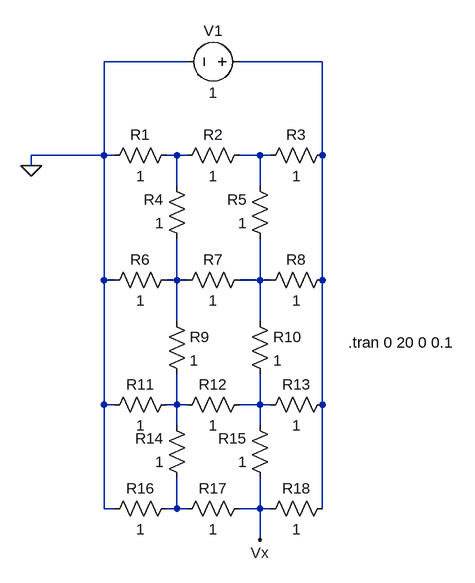
[diagram p0: schematic Q5b.asc]
Q5b.asc, the LTspice schematic file:
Version 4
SHEET 1 880 748
WIRE 144 -64 16 -64
WIRE 352 -64 224 -64
WIRE 16 80 16 -64
WIRE 16 80 -96 80
WIRE 32 80 16 80
WIRE 128 80 112 80
WIRE 144 80 128 80
WIRE 256 80 224 80
WIRE 272 80 256 80
WIRE 352 80 352 -64
WIRE -96 96 -96 80
WIRE 128 128 128 80
WIRE 256 128 256 80
WIRE 16 272 16 80
WIRE 32 272 16 272
WIRE 128 272 128 208
WIRE 128 272 112 272
WIRE 144 272 128 272
WIRE 256 272 256 208
WIRE 256 272 224 272
WIRE 272 272 256 272
WIRE 352 272 352 80
WIRE 128 336 128 272
WIRE 256 336 256 272
WIRE 16 464 16 272
WIRE 32 464 16 464
WIRE 128 464 128 416
WIRE 128 464 112 464
WIRE 144 464 128 464
WIRE 256 464 256 416
WIRE 256 464 224 464
WIRE 272 464 256 464
WIRE 352 464 352 272
WIRE 128 496 128 464
WIRE 256 496 256 464
WIRE 16 624 16 464
WIRE 32 624 16 624
WIRE 128 624 128 576
WIRE 128 624 112 624
WIRE 144 624 128 624
WIRE 256 624 256 576
WIRE 256 624 224 624
WIRE 272 624 256 624
WIRE 352 624 352 464
WIRE 256 672 256 624
FLAG -96 96 0
FLAG 256 672 Vx
SYMBOL res 128 64 R90
WINDOW 0 0 56 VBottom 2
WINDOW 3 32 56 VTop 2
SYMATTR InstName R1
SYMATTR Value 1
SYMBOL res 240 64 R90
WINDOW 0 0 56 VBottom 2
WINDOW 3 32 56 VTop 2
SYMATTR InstName R2
SYMATTR Value 1
SYMBOL res 368 64 R90
WINDOW 0 0 56 VBottom 2
WINDOW 3 32 56 VTop 2
SYMATTR InstName R3
SYMATTR Value 1
SYMBOL res 144 224 R180
WINDOW 0 36 76 Left 2
WINDOW 3 36 40 Left 2
SYMATTR InstName R4
SYMATTR Value 1
SYMBOL res 272 224 R180
WINDOW 0 36 76 Left 2
WINDOW 3 36 40 Left 2
SYMATTR InstName R5
SYMATTR Value 1
SYMBOL res 16 288 R270
WINDOW 0 32 56 VTop 2
WINDOW 3 0 56 VBottom 2
SYMATTR InstName R6
SYMATTR Value 1
SYMBOL res 128 288 R270
WINDOW 0 32 56 VTop 2
WINDOW 3 0 56 VBottom 2
SYMATTR InstName R7
SYMATTR Value 1
SYMBOL res 256 288 R270
WINDOW 0 32 56 VTop 2
WINDOW 3 0 56 VBottom 2
SYMATTR InstName R8
SYMATTR Value 1
SYMBOL res 112 320 R0
SYMATTR InstName R9
SYMATTR Value 1
SYMBOL res 240 320 R0
SYMATTR InstName R10
SYMATTR Value 1
SYMBOL res 128 448 R90
WINDOW 0 0 56 VBottom 2
WINDOW 3 32 56 VTop 2
SYMATTR InstName R11
SYMATTR Value 1
SYMBOL res 240 448 R90
WINDOW 0 0 56 VBottom 2
WINDOW 3 32 56 VTop 2
SYMATTR InstName R12
SYMATTR Value 1
SYMBOL res 368 448 R90
WINDOW 0 0 56 VBottom 2
WINDOW 3 32 56 VTop 2
SYMATTR InstName R13
SYMATTR Value 1
SYMBOL res 144 592 R180
WINDOW 0 36 76 Left 2
WINDOW 3 36 40 Left 2
SYMATTR InstName R14
SYMATTR Value 1
SYMBOL res 272 592 R180
WINDOW 0 36 76 Left 2
WINDOW 3 36 40 Left 2
SYMATTR InstName R15
SYMATTR Value 1
SYMBOL res 128 608 R90
WINDOW 0 0 56 VBottom 2
WINDOW 3 32 56 VTop 2
SYMATTR InstName R16
SYMATTR Value 1
SYMBOL res 240 608 R90
WINDOW 0 0 56 VBottom 2
WINDOW 3 32 56 VTop 2
SYMATTR InstName R17
SYMATTR Value 1
SYMBOL res 368 608 R90
WINDOW 0 0 56 VBottom 2
WINDOW 3 32 56 VTop 2
SYMATTR InstName R18
SYMATTR Value 1
SYMBOL voltage 240 -64 R90
WINDOW 0 -32 56 VBottom 2
WINDOW 3 32 56 VTop 2
WINDOW 123 0 0 Left 0
WINDOW 39 0 0 Left 0
SYMATTR InstName V1
SYMATTR Value 1
TEXT 392 368 Left 2 !.tran 0 20 0 0.1

The netlist it stands for:
* Q5b.asc
R1 N002 0 1
R2 N003 N002 1
R3 N001 N003 1
R4 N004 N002 1
R5 N005 N003 1
R6 0 N004 1
R7 N004 N005 1
R8 N005 N001 1
R9 N004 N006 1
R10 N005 N007 1
R11 N006 0 1
R12 N007 N006 1
R13 N001 N007 1
R14 N008 N006 1
R15 Vx N007 1
R16 N008 0 1
R17 Vx N008 1
R18 N001 Vx 1
V1 N001 0 1
.tran 0 20 0 0.1
.backanno
.end